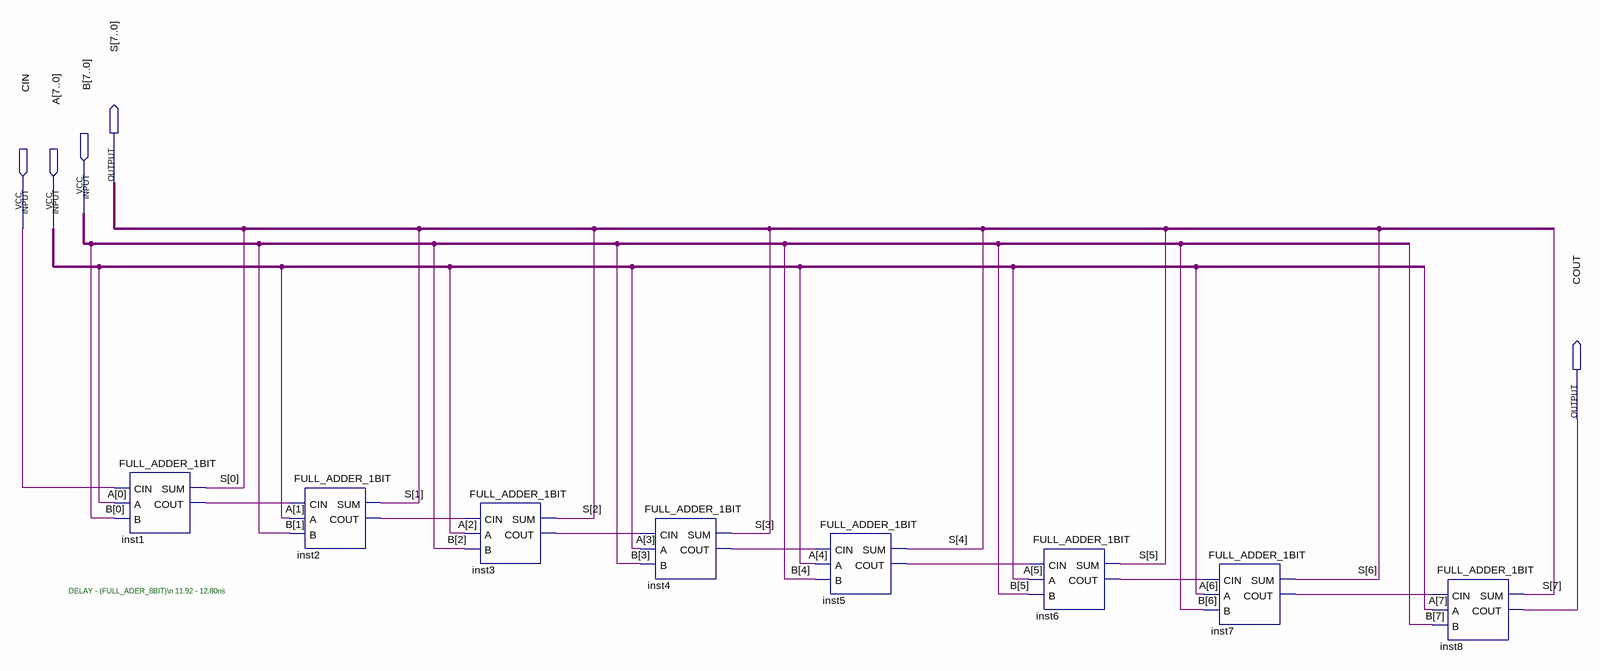
[diagram p0: schematic sheet]
// Quartus schematic FULL_ADDER_8BIT.bdf as structural Verilog: 8 symbols, 5 pins
module FULL_ADDER_8BIT (
  input  [7:0] B,
  input  CIN,
  input  [7:0] A,
  output [7:0] S,
  output COUT
);

  wire inst1_cout, inst2_cout, inst3_cout, inst4_cout, inst5_cout, inst6_cout, inst7_cout;

  FULL_ADDER_1BIT inst1 (.CIN(CIN), .A(A[0]), .B(B[0]), .SUM(S[0]), .COUT(inst1_cout));
  FULL_ADDER_1BIT inst2 (.CIN(inst1_cout), .A(A[1]), .B(B[1]), .SUM(S[1]), .COUT(inst2_cout));
  FULL_ADDER_1BIT inst3 (.CIN(inst2_cout), .A(A[2]), .B(B[2]), .SUM(S[2]), .COUT(inst3_cout));
  FULL_ADDER_1BIT inst4 (.CIN(inst3_cout), .A(A[3]), .B(B[3]), .SUM(S[3]), .COUT(inst4_cout));
  FULL_ADDER_1BIT inst5 (.CIN(inst4_cout), .A(A[4]), .B(B[4]), .SUM(S[4]), .COUT(inst5_cout));
  FULL_ADDER_1BIT inst6 (.CIN(inst5_cout), .A(A[5]), .B(B[5]), .SUM(S[5]), .COUT(inst6_cout));
  FULL_ADDER_1BIT inst7 (.CIN(inst6_cout), .A(A[6]), .B(B[6]), .SUM(S[6]), .COUT(inst7_cout));
  FULL_ADDER_1BIT inst8 (.CIN(inst7_cout), .A(A[7]), .B(B[7]), .SUM(S[7]), .COUT(COUT));

  // Notes on the sheet:
  //   DELAY - (FULL_ADER_8BIT)\n 11.92 - 12.80ns
endmodule
